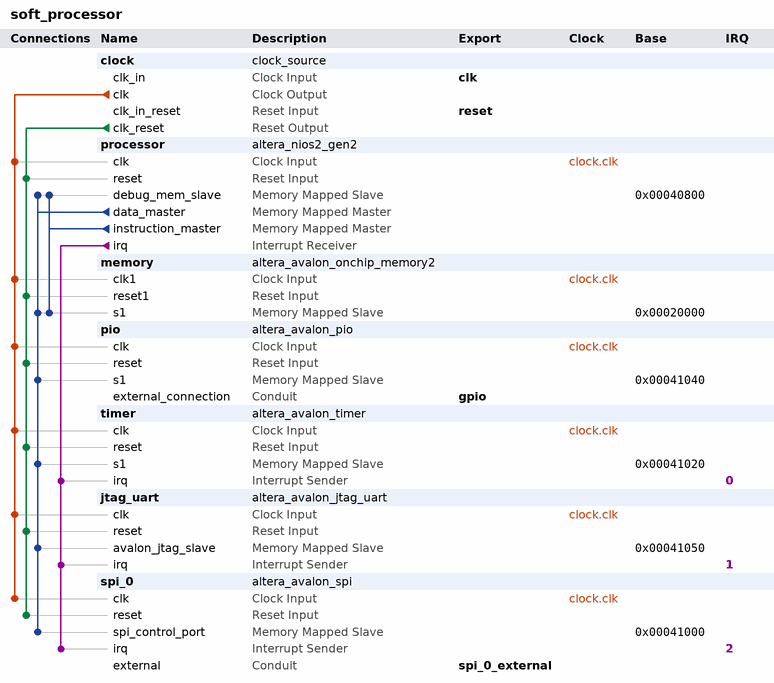
[diagram p0: system contents]
# Platform Designer (Qsys) system soft_processor, Cyclone V 5CSEMA4U23C6
# Parameters at their usual value, and those the tool derives, are not listed.
package require -exact qsys 18.1
create_system soft_processor
set_project_property DEVICE_FAMILY {Cyclone V}
set_project_property DEVICE 5CSEMA4U23C6

add_instance clock clock_source 18.1
set_instance_parameter_value clock clockFrequency 50000000

add_instance processor altera_nios2_gen2 18.1
set_instance_parameter_value processor dcache_size 2048
set_instance_parameter_value processor exceptionSlave memory.s1
set_instance_parameter_value processor icache_size 4096
set_instance_parameter_value processor impl Tiny
set_instance_parameter_value processor resetSlave memory.s1

add_instance memory altera_avalon_onchip_memory2 18.1
set_instance_parameter_value memory dataWidth 32
set_instance_parameter_value memory dualPort false
set_instance_parameter_value memory initMemContent true
set_instance_parameter_value memory initializationFileName onchip_mem.hex
set_instance_parameter_value memory memorySize 131072

add_instance pio altera_avalon_pio 18.1
set_instance_parameter_value pio direction Output
set_instance_parameter_value pio width 8

add_instance timer altera_avalon_timer 18.1
set_instance_parameter_value timer period 1
set_instance_parameter_value timer periodUnits MSEC

add_instance jtag_uart altera_avalon_jtag_uart 18.1
set_instance_parameter_value jtag_uart simInteractiveOptions NO_INTERACTIVE_WINDOWS

add_instance spi_0 altera_avalon_spi 18.1
set_instance_parameter_value spi_0 clockPolarity 0
set_instance_parameter_value spi_0 dataWidth 8
set_instance_parameter_value spi_0 masterSPI true
set_instance_parameter_value spi_0 numberOfSlaves 1
set_instance_parameter_value spi_0 targetClockRate 5000000

# connections
add_connection clock.clk jtag_uart.clk clock
add_connection clock.clk memory.clk1 clock
add_connection clock.clk pio.clk clock
add_connection clock.clk processor.clk clock
add_connection clock.clk spi_0.clk clock
add_connection clock.clk timer.clk clock
add_connection clock.clk_reset jtag_uart.reset reset
add_connection clock.clk_reset memory.reset1 reset
add_connection clock.clk_reset pio.reset reset
add_connection clock.clk_reset processor.reset reset
add_connection clock.clk_reset spi_0.reset reset
add_connection clock.clk_reset timer.reset reset
add_connection processor.data_master jtag_uart.avalon_jtag_slave avalon
set_connection_parameter_value processor.data_master/jtag_uart.avalon_jtag_slave baseAddress 0x00041050
add_connection processor.data_master memory.s1 avalon
set_connection_parameter_value processor.data_master/memory.s1 baseAddress 0x00020000
add_connection processor.data_master pio.s1 avalon
set_connection_parameter_value processor.data_master/pio.s1 baseAddress 0x00041040
add_connection processor.data_master processor.debug_mem_slave avalon
set_connection_parameter_value processor.data_master/processor.debug_mem_slave baseAddress 0x00040800
add_connection processor.data_master spi_0.spi_control_port avalon
set_connection_parameter_value processor.data_master/spi_0.spi_control_port baseAddress 0x00041000
add_connection processor.data_master timer.s1 avalon
set_connection_parameter_value processor.data_master/timer.s1 baseAddress 0x00041020
add_connection processor.instruction_master memory.s1 avalon
set_connection_parameter_value processor.instruction_master/memory.s1 baseAddress 0x00020000
add_connection processor.instruction_master processor.debug_mem_slave avalon
set_connection_parameter_value processor.instruction_master/processor.debug_mem_slave baseAddress 0x00040800
add_connection processor.irq jtag_uart.irq interrupt
set_connection_parameter_value processor.irq/jtag_uart.irq irqNumber 1
add_connection processor.irq spi_0.irq interrupt
set_connection_parameter_value processor.irq/spi_0.irq irqNumber 2
add_connection processor.irq timer.irq interrupt
set_connection_parameter_value processor.irq/timer.irq irqNumber 0

# exported interfaces
add_interface clk clock sink
set_interface_property clk EXPORT_OF clock.clk_in
add_interface gpio conduit end
set_interface_property gpio EXPORT_OF pio.external_connection
add_interface reset reset sink
set_interface_property reset EXPORT_OF clock.clk_in_reset
add_interface spi_0_external conduit end
set_interface_property spi_0_external EXPORT_OF spi_0.external

set_interconnect_requirement {$system} qsys_mm.clockCrossingAdapter HANDSHAKE
set_interconnect_requirement {$system} qsys_mm.enableEccProtection FALSE
set_interconnect_requirement {$system} qsys_mm.insertDefaultSlave FALSE
set_interconnect_requirement {$system} qsys_mm.maxAdditionalLatency 1

save_system soft_processor.qsys
